# Altium schematic sheet LTC2983_Group_.SchDoc
size A4; CompanyName: Technische Hochschule Nürnberg Georg Simon Ohm; Organization: UltraZohm; Address1: Kesslerplatz 12; Address2: 90489 Nürnberg; Address3: GERMANY; Website: www.ultrazohm.com
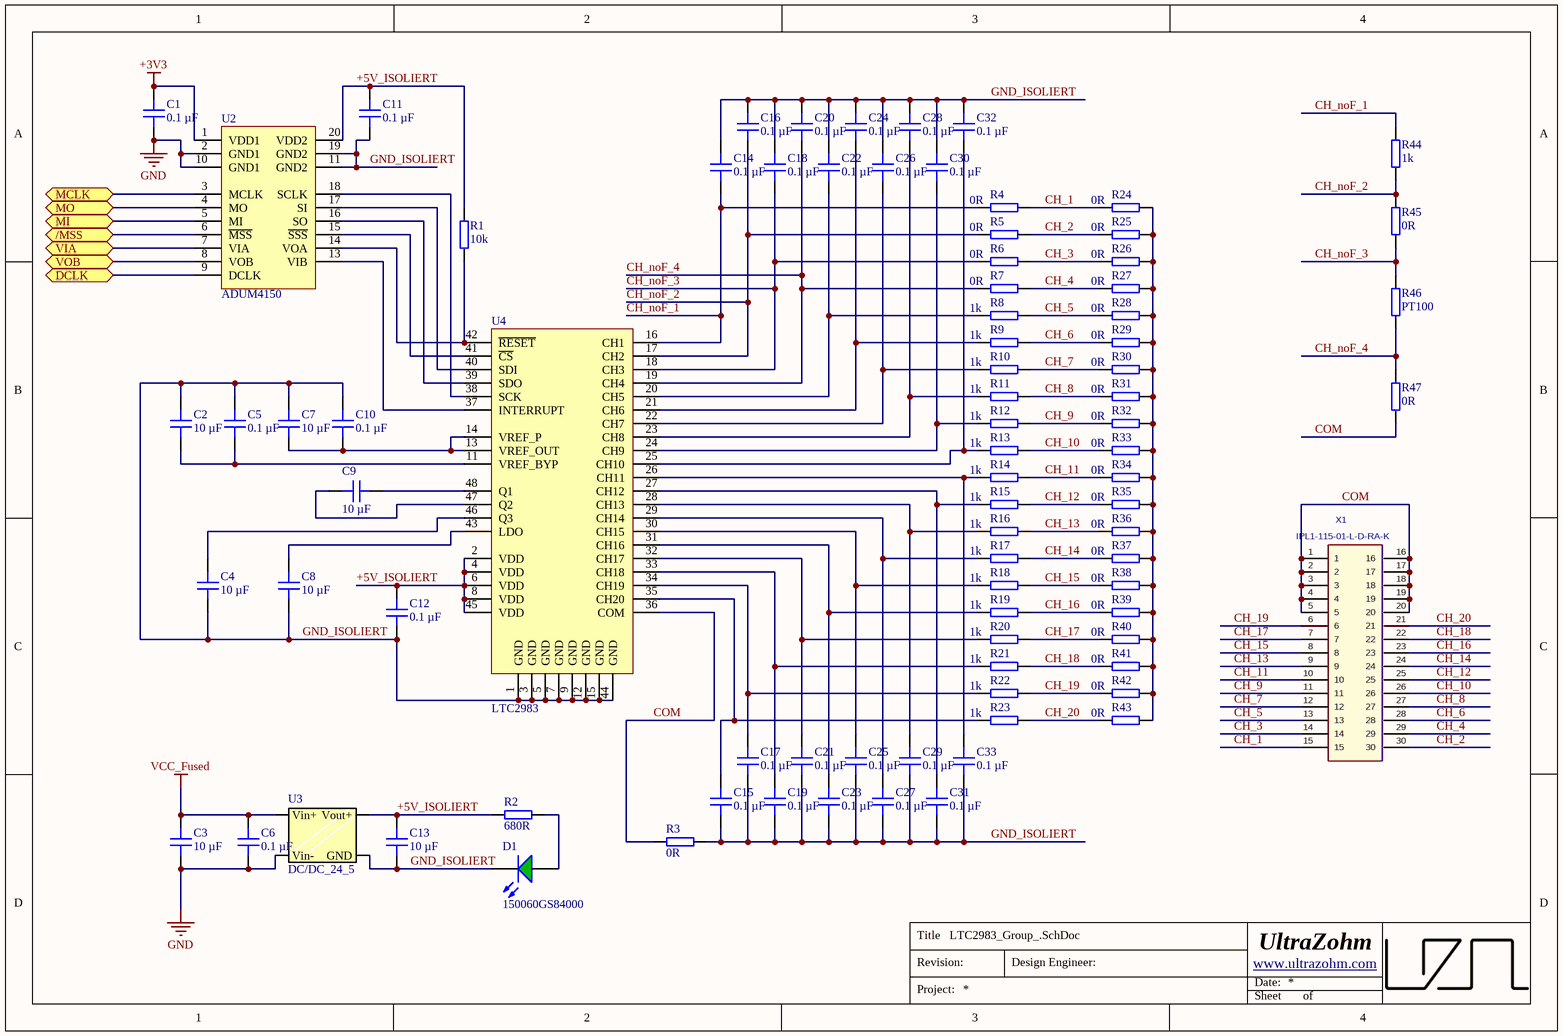
[diagram p0: LTC2983_Group_.SchDoc]

## Parts
C1  0.1 µF  [C_0603]
C2  10 µF  [C_0603]
C3  10 µF  [C_0603]
C4  10 µF  [C_0603]
C5  0.1 µF  [C_0603]
C6  0.1 µF  [C_0603]
C7  10 µF  [C_0603]
C8  10 µF  [C_0603]
C9  10 µF  [C_0603]
C10  0.1 µF  [C_0603]
C11  0.1 µF  [C_0603]
C12  0.1 µF  [C_0603]
C13  10 µF  [C_0603]
C14  0.1 µF  [C_0603]
C15  0.1 µF  [C_0603]
C16  0.1 µF  [C_0603]
C17  0.1 µF  [C_0603]
C18  0.1 µF  [C_0603]
C19  0.1 µF  [C_0603]
C20  0.1 µF  [C_0603]
C21  0.1 µF  [C_0603]
C22  0.1 µF  [C_0603]
C23  0.1 µF  [C_0603]
C24  0.1 µF  [C_0603]
C25  0.1 µF  [C_0603]
C26  0.1 µF  [C_0603]
C27  0.1 µF  [C_0603]
C28  0.1 µF  [C_0603]
C29  0.1 µF  [C_0603]
C30  0.1 µF  [C_0603]
C31  0.1 µF  [C_0603]
C32  0.1 µF  [C_0603]
C33  0.1 µF  [C_0603]
D1  150060GS84000  [WL-SMCW_0603]
R1  10k  [RES 0603_1608]
R2  680R  [RES 0603_1608]
R3  0R  [RES 0603_1608]
R4  0R  [RES 0603_1608]
R5  0R  [RES 0603_1608]
R6  0R  [RES 0603_1608]
R7  0R  [RES 0603_1608]
R8  1k  [RES 0603_1608]
R9  1k  [RES 0603_1608]
R10  1k  [RES 0603_1608]
R11  1k  [RES 0603_1608]
R12  1k  [RES 0603_1608]
R13  1k  [RES 0603_1608]
R14  1k  [RES 0603_1608]
R15  1k  [RES 0603_1608]
R16  1k  [RES 0603_1608]
R17  1k  [RES 0603_1608]
R18  1k  [RES 0603_1608]
R19  1k  [RES 0603_1608]
R20  1k  [RES 0603_1608]
R21  1k  [RES 0603_1608]
R22  1k  [RES 0603_1608]
R23  1k  [RES 0603_1608]
R24  0R  [RES 0603_1608]
R25  0R  [RES 0603_1608]
R26  0R  [RES 0603_1608]
R27  0R  [RES 0603_1608]
R28  0R  [RES 0603_1608]
R29  0R  [RES 0603_1608]
R30  0R  [RES 0603_1608]
R31  0R  [RES 0603_1608]
R32  0R  [RES 0603_1608]
R33  0R  [RES 0603_1608]
R34  0R  [RES 0603_1608]
R35  0R  [RES 0603_1608]
R36  0R  [RES 0603_1608]
R37  0R  [RES 0603_1608]
R38  0R  [RES 0603_1608]
R39  0R  [RES 0603_1608]
R40  0R  [RES 0603_1608]
R41  0R  [RES 0603_1608]
R42  0R  [RES 0603_1608]
R43  0R  [RES 0603_1608]
R44  1k  [RES 0603_1608]
R45  0R  [RES 0603_1608]
R46  PT100  [RES 0603_1608]
R47  0R  [RES 0603_1608]
U2  ADUM4150  [SOIC-20-ADUM4150]
U3  DC/DC_24_5  [SIP4DCDC]
U4  LTC2983  [48_LGFP(7x7)]
X1  IPL1-115-01-L-D-RA-K  [IPL1-115-01-XX-D-RA]

## Ports
/MSS (bidir), DCLK (bidir), MCLK (bidir), MI (bidir), MO (bidir), VIA (bidir), VOB (bidir)

## Nets
+3V3: C1.2 U2.1(VDD1)
GND: C1.1 C3.1 C6.1 U2.2(GND1) U2.10(GND1) U3.2(Vin-)
VCC_Fused: C3.2 C6.2 U3.1(Vin+)
+5V_ISOLIERT: C11.2 C12.2 C13.2 R1.2 R2.1 U2.20(VDD2) U3.6(Vout+) U4.2(VDD) U4.4(VDD) U4.6(VDD) U4.8(VDD) U4.45(VDD)
/MSS: U2.6(~{MSS}) ; port /MSS
CH_1: R4.2 R24.1 X1.15
CH_2: R5.2 R25.1 X1.30
CH_3: R6.2 R26.1 X1.14
CH_4: R7.2 R27.1 X1.29
CH_5: R8.2 R28.1 X1.13
CH_6: R9.2 R29.1 X1.28
CH_7: R10.2 R30.1 X1.12
CH_8: R11.2 R31.1 X1.27
CH_9: R12.2 R32.1 X1.11
CH_10: R13.2 R33.1 X1.26
CH_11: R14.2 R34.1 X1.10
CH_12: R15.2 R35.1 X1.25
CH_13: R16.2 R36.1 X1.9
CH_14: R17.2 R37.1 X1.24
CH_15: R18.2 R38.1 X1.8
CH_16: R19.2 R39.1 X1.23
CH_17: R20.2 R40.1 X1.7
CH_18: R21.2 R41.1 X1.22
CH_19: R22.2 R42.1 X1.6
CH_20: R23.2 R43.1 X1.21
CH_noF_1: C14.1 R4.1 R44.2 U4.16(CH1)
CH_noF_2: C16.1 R5.1 R44.1 R45.2 U4.17(CH2)
CH_noF_3: C18.1 R6.1 R45.1 R46.2 U4.18(CH3)
CH_noF_4: C20.1 R7.1 R46.1 R47.2 U4.19(CH4)
COM: R3.1 R47.1 U4.36(COM) X1.1 X1.2 X1.3 X1.4 X1.5 X1.16 X1.17 X1.18 X1.19 X1.20
DCLK: U2.9(DCLK) ; port DCLK
GND_ISOLIERT: C2.2 C4.1 C5.2 C7.2 C8.1 C10.2 C11.1 C12.1 C13.1 C14.2 C15.1 C16.2 C17.1 C18.2 C19.1 C20.2 C21.1 C22.2 C23.1 C24.2 C25.1 C26.2 C27.1 C28.2 C29.1 C30.2 C31.1 C32.2 C33.1 D1.1(K) R3.2 U2.11(GND2) U2.19(GND2) U3.4(GND) U4.1(GND) U4.3(GND) U4.5(GND) U4.7(GND) U4.9(GND) U4.12(GND) U4.15(GND) U4.44(GND)
MCLK: U2.3(MCLK) ; port MCLK
MI: U2.5(MI) ; port MI
MO: U2.4(MO) ; port MO
VIA: U2.7(VIA) ; port VIA
VOB: U2.8(VOB) ; port VOB
NetC2_1: C2.1 C5.1 U4.11(VREF_BYP)
NetC4_2: C4.2 U4.46(Q3)
NetC7_1: C7.1 C10.1 U4.13(VREF_OUT) U4.14(VREF_P)
NetC8_2: C8.2 U4.43(LDO)
NetC9_1: C9.1 U4.48(Q1)
NetC9_2: C9.2 U4.47(Q2)
NetC15_2: C15.2 R23.1 U4.35(CH20)
NetC17_2: C17.2 R22.1 U4.34(CH19)
NetC19_2: C19.2 R21.1 U4.33(CH18)
NetC21_2: C21.2 R20.1 U4.32(CH17)
NetC22_1: C22.1 R8.1 U4.20(CH5)
NetC23_2: C23.2 R19.1 U4.31(CH16)
NetC24_1: C24.1 R9.1 U4.21(CH6)
NetC25_2: C25.2 R18.1 U4.30(CH15)
NetC26_1: C26.1 R10.1 U4.22(CH7)
NetC27_2: C27.2 R17.1 U4.29(CH14)
NetC28_1: C28.1 R11.1 U4.23(CH8)
NetC29_2: C29.2 R16.1 U4.28(CH13)
NetC30_1: C30.1 R12.1 U4.24(CH9)
NetC31_2: C31.2 R15.1 U4.27(CH12)
NetC32_1: C32.1 R13.1 U4.25(CH10)
NetC33_2: C33.2 R14.1 U4.26(CH11)
NetD1_2: D1.2(A) R2.2
NetR1_1: R1.1 U2.14(VOA) U4.42(~{RESET})
NetR24_2: R24.2 R25.2 R26.2 R27.2 R28.2 R29.2 R30.2 R31.2 R32.2 R33.2 R34.2 R35.2 R36.2 R37.2 R38.2 R39.2 R40.2 R41.2 R42.2 R43.2
NetU2_13: U2.13(VIB) U4.37(INTERRUPT)
NetU2_15: U2.15(~{SSS}) U4.41(~{CS})
NetU2_16: U2.16(SO) U4.39(SDO)
NetU2_17: U2.17(SI) U4.40(SDI)
NetU2_18: U2.18(SCLK) U4.38(SCK)

## Notes on the sheet
- Title
- Revision:
- Design Engineer:
- Date:
- Project:
- Sheet
- of

## Library data of the parts
C1 C5 C6 C10-C12 C14-C33 = C0603X104K5RAC7411: Capacitor 0603, 50 VDC, 0.1 µF, X7R; Manufacturer: KEMET; Tolerance: 10 %; Voltage Rating: 50 VDC; Created from: MGremer; Manufacturer Part Number: C0603X104K5RAC7411; PartID: 3; Created On: 20.12.2020 13:54:13; ComponentLink1Description: Datasheet; ComponentLink1URL: https://www.mouser.de/datasheet/2/212/1/KEM_C1013_X7R_FT_CAP_SMD-1103280.pdf; Component Type: Capacitor 0603; Device Package: 0603; Last Updated: 04.03.2021 09:24:28; Mounting Type: SMD; Operating Temperature: -55 - 125°C; Series: SMD Comm X7R Flex; Supplier 1: Mouser; Supplier Part Number 1: 80-C0603X104K5R7411; Type: Capacitor; Value: 0.1 µF; Live Cycle Status: 1; Stock number: Labor SMD Container; Supplier 2: LCSC; Supplier Part Number 2: C14663; LCSC Part Number: C14663
C2-C4 C7-C9 C13 = GRM185R60J106ME15D: Capacitor 0603, 6.3 VDC, 10 µF, X5R; Manufacturer: muRata; Tolerance: 20 %; Voltage Rating: 6.3 VDC; Created from: MGremer; Manufacturer Part Number: GRM185R60J106ME15D; PartID: 10; Created On: 20.12.2020 13:54:13; ComponentLink1Description: Datasheet; ComponentLink1URL: https://www.mouser.de/datasheet/2/281/murata_03052018_GRM_Series_1-1310166.pdf; Component Type: Capacitor 0603; Device Package: 0603; Last Updated: 27.05.2022 14:13:40; Mounting Type: SMD; Operating Temperature: -55 - 85°C; Series: GRM; Supplier 1: Mouser; Supplier Part Number 1: 81-GRM185R60J106ME5D; Type: Capacitor; Value: 10 µF; Live Cycle Status: 1; Stock number: Labor SMD Container; LCSC Part Number: C19702
D1 = 150060GS84000: WL-SMCW SMD Mono-color Chip LED Waterclear Green; Manufacturer: Wuerth Elektronik; Type: Standard; Created from: MGremer; Forward Current I_f: 20 mA; Forward Voltage U_f: 3.2 V; Wavelength: 525 nm; Light Intensity: 3000 mcd; Nominal Power: 78 mW; Manufacturer Part Number: 150060GS84000; PartID: 2; Created On: 08.12.2020 10:41:11; ComponentLink1Description: Datasheet; ComponentLink1URL: https://www.mouser.de/datasheet/2/445/150060GS75020-1714345.pdf; Component Type: LED Diode; Device Package: 0603; Last Updated: 25.01.2024 19:29:32; Mounting Type: SMD; Operating Temperature: -40 - 85 °C; Supplier 1: Mouser; Supplier Part Number 1: 710-150060GS84000; Supplier 2: Farnell; Supplier Part Number 2: 3408612; Supplier 3: Digi-Key; Supplier Part Number 3: 732-150060GS84000CT-ND; Live Cycle Status: 1; Stock number: not stored; Color: green; LCSC Part Number: C72043
R1 = RK73B1JTTD103J: SMD resistor E24 series; Manufacturer: KOA Speer; Tolerance: 5%; Created from: MGremer; Manufacturer Part Number: RK73B1JTTD103J; PartID: 98; Created On: 14.12.2020 16:17:14; ComponentLink1Description: Datasheet; ComponentLink1URL: https://www.mouser.de/datasheet/2/219/RK73B-1825463.pdf; Component Type: SMD resistor; Device Package: 0603; Last Updated: 27.05.2022 14:04:22; Mounting Type: SMD; Supplier 1: Mouser; Supplier Part Number 1: 660-RK73B1JTTD103J; Type: Resistor; Value: 10k; Live Cycle Status: 1; Stock number: Labor SMD Container; LCSC Part Number: C25804
R2 = RK73B1JTTDD681J: SMD resistor E24 series; Manufacturer: KOA Speer; Tolerance: 5%; Created from: MGremer; Manufacturer Part Number: RK73B1JTTDD681J; PartID: 70; Created On: 14.12.2020 16:17:14; ComponentLink1Description: Datasheet; ComponentLink1URL: https://www.mouser.de/datasheet/2/219/RK73B-1825463.pdf; Component Type: SMD resistor; Device Package: 0603; Last Updated: 27.05.2022 08:00:04; Mounting Type: SMD; Supplier 1: Mouser; Supplier Part Number 1: 660-RK73B1JTTDD681J; Type: Resistor; Value: 680R; Live Cycle Status: 1; Stock number: Labor SMD Container; Supplier 2: LCSC; Supplier Part Number 2: C23228; LCSC Part Number: C23228
R3-R7 R24-R43 R45 R47 = RC0603JR-070RL: SMD resistor E24 series; Manufacturer: YAGEO; Tolerance: 5%; Created from: MGremer; Manufacturer Part Number: RC0603JR-070RL; PartID: 1; Created On: 14.12.2020 16:17:14; ComponentLink1Description: Datasheet; ComponentLink1URL: https://www.mouser.de/datasheet/2/447/PYu-RC_Group_51_RoHS_L_10-1664068.pdf; Component Type: SMD resistor; Device Package: 0603; Last Updated: 04.03.2021 09:09:42; Mounting Type: SMD; Supplier 1: Mouser; Supplier Part Number 1: 603-RC0603JR-070RL; Supplier 2: LCSC; Supplier Part Number 2: C21189; Type: Resistor; Value: 0R; Live Cycle Status: 1; Stock number: Labor SMD Container; LCSC Part Number: C21189
R8-R23 = 0603WAF1001T5E: SMD resistor E24 series; Manufacturer: UNI-ROYAL; Tolerance: 1%; Created from: AGeiger; Manufacturer Part Number: 0603WAF1001T5E; PartID: 74; Created On: 14.12.2020 16:17:14; ComponentLink1Description: Datasheet; ComponentLink1URL: https://datasheet.lcsc.com/lcsc/2206010130_UNI-ROYAL-Uniroyal-Elec-0603WAF1001T5E_C21190.pdf; Component Type: SMD resistor; Device Package: 0603; Last Updated: 25.08.2022 16:01:46; Mounting Type: SMD; Supplier 1: LCSC; Supplier Part Number 1: C21190; Type: Resistor; Value: 1k; Live Cycle Status: 1; Stock number: Labor SMD Container; LCSC Part Number: C21190
R44 = PCF-W0603LF-03-1001-B-P-LT: SMD resistor 0.1%; Manufacturer: IRC / TT Electronics; Created from: MGremer; Manufacturer Part Number: PCF-W0603LF-03-1001-B-P-LT; PartID: 163; Created On: 14.12.2020 16:17:14; ComponentLink1Description: Datasheet; ComponentLink1URL: https://www.mouser.de/datasheet/2/414/PCF-1528243.pdf; Component Type: SMD resistor; Device Package: 0603; Last Updated: 02.03.2021 14:07:32; Mounting Type: SMD; Supplier 1: Mouser; Supplier Part Number 1: 66-PCFW0603LF031001B; Type: Resistor; Tolerance: 0.1%; Value: 1k; Live Cycle Status: 1; Stock number: not stored
R46 = PCF-W0603LF-03-1001-B-P-LT: SMD resistor 0.1%; Manufacturer: IRC / TT Electronics; Value: 1k; Created from: MGremer; Manufacturer Part Number: PCF-W0603LF-03-1001-B-P-LT; PartID: 163; Created On: 14.12.2020 16:17:14; ComponentLink1Description: Datasheet; ComponentLink1URL: https://www.mouser.de/datasheet/2/414/PCF-1528243.pdf; Component Type: SMD resistor; Device Package: 0603; Last Updated: 02.03.2021 14:07:32; Mounting Type: SMD; Supplier 1: Mouser; Supplier Part Number 1: 66-PCFW0603LF031001B; Type: Resistor; Tolerance: 0.1%; Live Cycle Status: 1; Stock number: not stored
U3 = DC/DC_Single: pin to pad: 1>2 2>1 4>3 6>4; LCSC Part Number: C970824
X1 = IPL1-115-01-L-D-RA-K: Terminal Assembly, Double Row, Right Angle, Thru-Hole, 2.54 mm x 2.54 mm Pitch, 30 Pins; Manufacturer: SAMTEC; Created from: TWendt; Number of positions: 30; Manufacturer Part Number: IPL1-115-01-L-D-RA-K; PartID: 34; Created On: 12.02.2021 15:31:18; ComponentLink1Description: Homepage; ComponentLink1URL: https://www.samtec.com/products/ipl1; Component Type: Samtec Connector; Device Package: Connector; Last Updated: 15.02.2021 10:07:42; Supplier 1: SAMTEC; Supplier Part Number 1: IPL1-115-01-L-D-RA-K; Type: Connector; Live Cycle Status: 1; Number of rows: 2; Stock number: not stored; LCSC Part Number: C7423882
U2 = ADUM4150: LCSC Part Number: C660948
U4 = LTC2983: LCSC Part Number: C427448